# Altium schematic sheet led_show.SchDoc
size A4
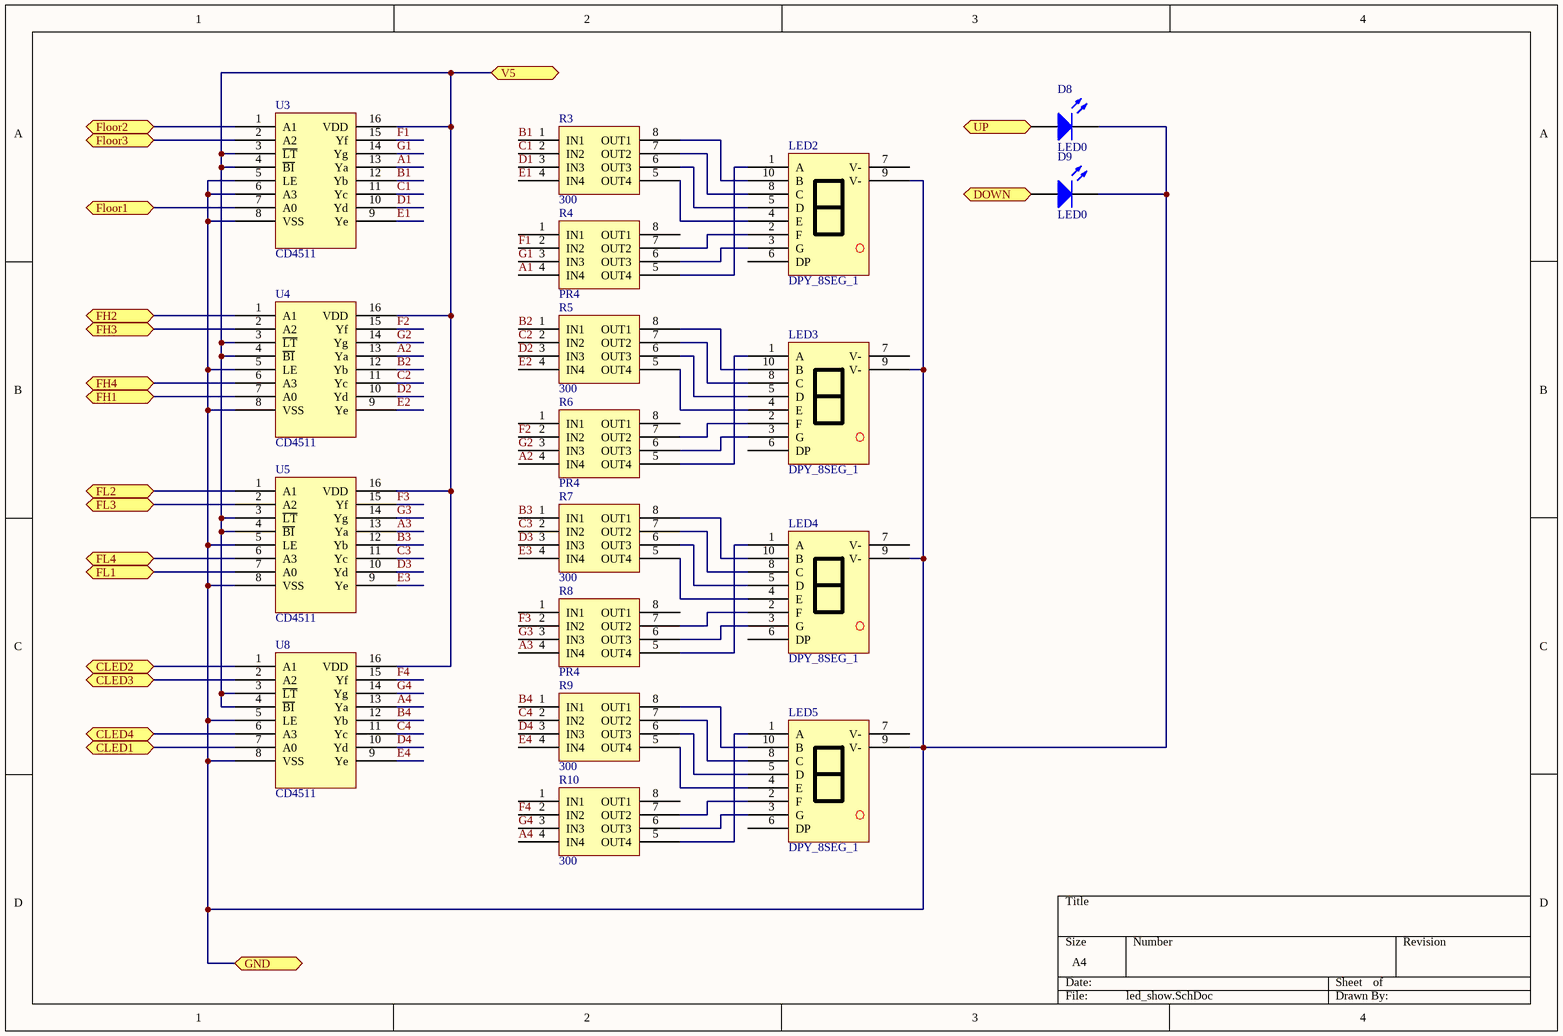
[diagram p0: led_show.SchDoc]

## Parts
D8  LED0  [1206]
D9  LED0  [1206]
LED2  DPY_8SEG_1  [LED_SEG8]
LED3  DPY_8SEG_1  [LED_SEG8]
LED4  DPY_8SEG_1  [LED_SEG8]
LED5  DPY_8SEG_1  [LED_SEG8]
R3  300  [PR_4R]
R4  PR4  [PR_4R]
R5  300  [PR_4R]
R6  PR4  [PR_4R]
R7  300  [PR_4R]
R8  PR4  [PR_4R]
R9  300  [PR_4R]
R10  300  [PR_4R]
U3  CD4511  [SOP-16]
U4  CD4511  [SOP-16]
U5  CD4511  [SOP-16]
U8  CD4511  [SOP-16]

## Ports
CLED1, CLED2, CLED3, CLED4, DOWN, FH1, FH2, FH3, FH4, FL1, FL2, FL3, FL4, Floor1, Floor2, Floor3, GND, UP, V5

## Nets
A1: R4.4(IN4) U3.13(Ya)
A2: R6.4(IN4) U4.13(Ya)
A3: R8.4(IN4) U5.13(Ya)
A4: R10.4(IN4) U8.13(Ya)
B1: R3.1(IN1) U3.12(Yb)
B2: R5.1(IN1) U4.12(Yb)
B3: R7.1(IN1) U5.12(Yb)
B4: R9.1(IN1) U8.12(Yb)
C1: R3.2(IN2) U3.11(Yc)
C2: R5.2(IN2) U4.11(Yc)
C3: R7.2(IN2) U5.11(Yc)
C4: R9.2(IN2) U8.11(Yc)
CLED1: U8.7(A0) ; port CLED1
CLED2: U8.1(A1) ; port CLED2
CLED3: U8.2(A2) ; port CLED3
CLED4: U8.6(A3) ; port CLED4
D1: R3.3(IN3) U3.10(Yd)
D2: R5.3(IN3) U4.10(Yd)
D3: R7.3(IN3) U5.10(Yd)
D4: R9.3(IN3) U8.10(Yd)
DOWN: D9.1(A) ; port DOWN
E1: R3.4(IN4) U3.9(Ye)
E2: R5.4(IN4) U4.9(Ye)
E3: R7.4(IN4) U5.9(Ye)
E4: R9.4(IN4) U8.9(Ye)
F1: R4.2(IN2) U3.15(Yf)
F2: R6.2(IN2) U4.15(Yf)
F3: R8.2(IN2) U5.15(Yf)
F4: R10.2(IN2) U8.15(Yf)
FH1: U4.7(A0) ; port FH1
FH2: U4.1(A1) ; port FH2
FH3: U4.2(A2) ; port FH3
FH4: U4.6(A3) ; port FH4
FL1: U5.7(A0) ; port FL1
FL2: U5.1(A1) ; port FL2
FL3: U5.2(A2) ; port FL3
FL4: U5.6(A3) ; port FL4
Floor1: U3.7(A0) ; port Floor1
Floor2: U3.1(A1) ; port Floor2
Floor3: U3.2(A2) ; port Floor3
G1: R4.3(IN3) U3.14(Yg)
G2: R6.3(IN3) U4.14(Yg)
G3: R8.3(IN3) U5.14(Yg)
G4: R10.3(IN3) U8.14(Yg)
GND: D8.2(K) D9.2(K) LED2.9(V-) LED3.9(V-) LED4.9(V-) LED5.9(V-) U3.5(LE) U3.6(A3) U3.8(VSS) U4.5(LE) U4.8(VSS) U5.5(LE) U5.8(VSS) U8.5(LE) U8.8(VSS) ; port GND
UP: D8.1(A) ; port UP
V5: U3.3(~{LT}) U3.4(~{BI}) U3.16(VDD) U4.3(~{LT}) U4.4(~{BI}) U4.16(VDD) U5.3(~{LT}) U5.4(~{BI}) U5.16(VDD) U8.3(~{LT}) U8.4(~{BI}) U8.16(VDD) ; port V5
NetLED2_1: LED2.1(A) R4.5(OUT4)
NetLED2_2: LED2.2(F) R4.7(OUT2)
NetLED2_3: LED2.3(G) R4.6(OUT3)
NetLED2_4: LED2.4(E) R3.5(OUT4)
NetLED2_5: LED2.5(D) R3.6(OUT3)
NetLED2_8: LED2.8(C) R3.7(OUT2)
NetLED2_10: LED2.10(B) R3.8(OUT1)
NetLED3_1: LED3.1(A) R6.5(OUT4)
NetLED3_2: LED3.2(F) R6.7(OUT2)
NetLED3_3: LED3.3(G) R6.6(OUT3)
NetLED3_4: LED3.4(E) R5.5(OUT4)
NetLED3_5: LED3.5(D) R5.6(OUT3)
NetLED3_8: LED3.8(C) R5.7(OUT2)
NetLED3_10: LED3.10(B) R5.8(OUT1)
NetLED4_1: LED4.1(A) R8.5(OUT4)
NetLED4_2: LED4.2(F) R8.7(OUT2)
NetLED4_3: LED4.3(G) R8.6(OUT3)
NetLED4_4: LED4.4(E) R7.5(OUT4)
NetLED4_5: LED4.5(D) R7.6(OUT3)
NetLED4_8: LED4.8(C) R7.7(OUT2)
NetLED4_10: LED4.10(B) R7.8(OUT1)
NetLED5_1: LED5.1(A) R10.5(OUT4)
NetLED5_2: LED5.2(F) R10.7(OUT2)
NetLED5_3: LED5.3(G) R10.6(OUT3)
NetLED5_4: LED5.4(E) R9.5(OUT4)
NetLED5_5: LED5.5(D) R9.6(OUT3)
NetLED5_8: LED5.8(C) R9.7(OUT2)
NetLED5_10: LED5.10(B) R9.8(OUT1)

Not connected (* = marked no-connect by the designer): LED2 6(DP) 7(V-); LED3 6(DP) 7(V-); LED4 6(DP) 7(V-); LED5 6(DP) 7(V-); R4 1(IN1) 8(OUT1); R6 1(IN1) 8(OUT1); R8 1(IN1) 8(OUT1); R10 1(IN1) 8(OUT1)

## Library data of the parts
D8 D9 = LED0: Typical INFRARED GaAs LED; Published: 8-Jun-2000; LatestRevisionDate: 08-Jul-2005; LatestRevisionNote: Mech Layer 1 removed.; PackageReference: LED-0; Publisher: Altium Limited; PackageDescription: LED; 2 Leads
LED2-LED5 = DPY8_1
R3-R10 = PResister